# Altium project ScopeMag.PrjPCB
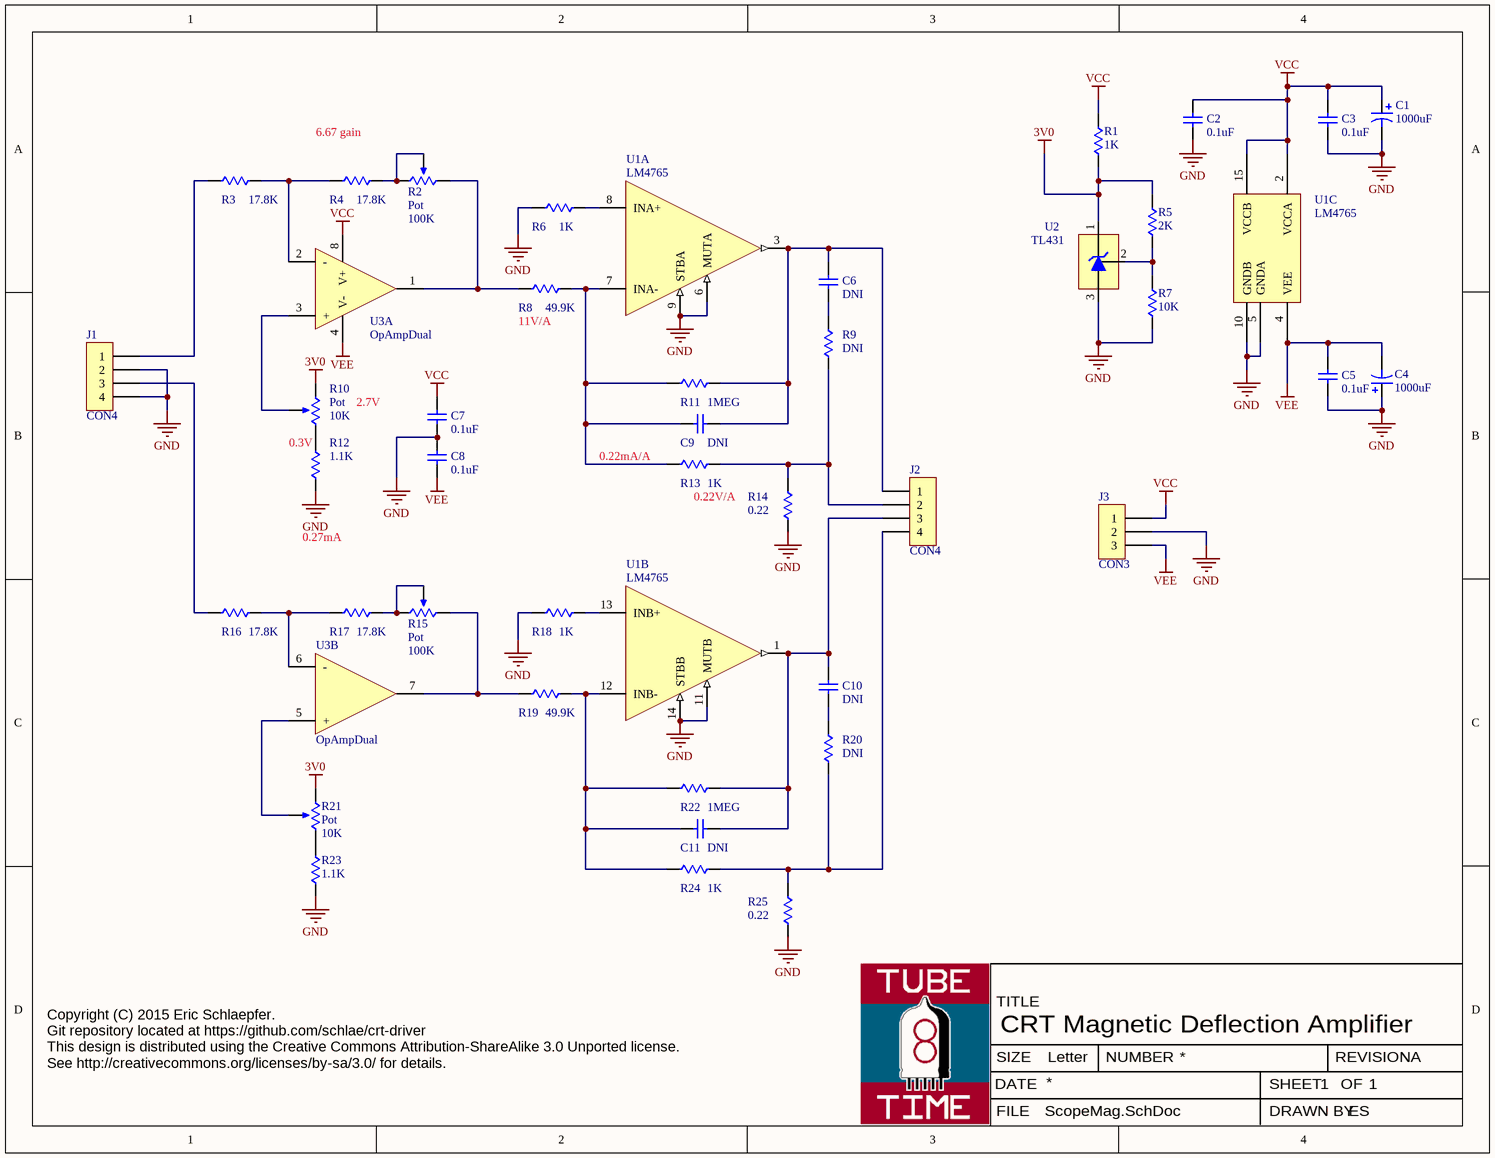
[diagram p0: ScopeMag.SchDoc]
1 sheet, 42 parts. Net scope: global (net labels, ports and power ports of the same name join across sheets).
Board file: ScopeMag.PcbDoc

## Sheet ScopeMag.SchDoc: CRT Magnetic Deflection Amplifier
size Letter; Organization: ES; Revision: A; SheetNumber: 1; SheetTotal: 1

### Parts
C1  value 1000uF  [CAP_R200x400]  (hidden comment: Cap Pol2)
C2  value 0.1uF  [G_0805[2012]]  (hidden comment: Cap)
C3  value 0.1uF  [G_0805[2012]]  (hidden comment: Cap)
C4  value 1000uF  [CAP_R200x400]  (hidden comment: Cap Pol2)
C5  value 0.1uF  [G_0805[2012]]  (hidden comment: Cap)
C6  value DNI  [G_0805[2012]]  (hidden comment: Cap)
C7  value 0.1uF  [G_0805[2012]]  (hidden comment: Cap)
C8  value 0.1uF  [G_0805[2012]]  (hidden comment: Cap)
C9  value DNI  [G_0805[2012]]  (hidden comment: Cap)
C10  value DNI  [G_0805[2012]]  (hidden comment: Cap)
C11  value DNI  [G_0805[2012]]  (hidden comment: Cap)
J1  CON4  [HDR4S]
J2  CON4  [HDR4S156]
J3  CON3  [HDR3S156]
R1  value 1K  [G_0805[2012]]  (hidden comment: Res1)
R2  Pot  value 100K  [POT_TRIM BOURNS 3386F]
R3  value 17.8K  [G_0805[2012]]  (hidden comment: Res1)
R4  value 17.8K  [G_0805[2012]]  (hidden comment: Res1)
R5  value 2K  [G_0805[2012]]  (hidden comment: Res1)
R6  value 1K  [G_0805[2012]]  (hidden comment: Res1)
R7  value 10K  [G_0805[2012]]  (hidden comment: Res1)
R8  value 49.9K  [G_0805[2012]]  (hidden comment: Res1)
R9  value DNI  [G_0805[2012]]  (hidden comment: Res1)
R10  Pot  value 10K  [POT_TRIM BOURNS 3386F]
R11  value 1MEG  [G_0805[2012]]  (hidden comment: Res1)
R12  value 1.1K  [G_0805[2012]]  (hidden comment: Res1)
R13  value 1K  [G_0805[2012]]  (hidden comment: Res1)
R14  value 0.22  [G_2512]  (hidden comment: Res1)
R15  Pot  value 100K  [POT_TRIM BOURNS 3386F]
R16  value 17.8K  [G_0805[2012]]  (hidden comment: Res1)
R17  value 17.8K  [G_0805[2012]]  (hidden comment: Res1)
R18  value 1K  [G_0805[2012]]  (hidden comment: Res1)
R19  value 49.9K  [G_0805[2012]]  (hidden comment: Res1)
R20  value DNI  [G_0805[2012]]  (hidden comment: Res1)
R21  Pot  value 10K  [POT_TRIM BOURNS 3386F]
R22  value 1MEG  [G_0805[2012]]  (hidden comment: Res1)
R23  value 1.1K  [G_0805[2012]]  (hidden comment: Res1)
R24  value 1K  [G_0805[2012]]  (hidden comment: Res1)
R25  value 0.22  [G_2512]  (hidden comment: Res1)
U1  LM4765  [LM4765]  (parts A,B,C of 3)
U2  TL431  [G_SOT23]
U3  OpAmpDual  [G_SO8]  (parts A,B of 2)

### Nets
3V0: R1.2 R5.1 R10.1(TOP) R21.1(TOP) U2.1(C)
GND: C1.2 C2.1 C3.1 C4.1 C5.1 C7.1 C8.2 J1.2 J1.4 J3.2 R6.1 R7.2 R12.2 R14.2 R18.1 R23.2 R25.2 U1.5(GNDA) U1.6(MUTA) U1.9(STBA) U1.10(GNDB) U1.11(MUTB) U1.14(STBB) U2.3(A)
VCC: C1.1 C2.2 C3.2 C7.2 J3.1 R1.1 U1.2(VCCA) U1.15(VCCB) U3.8(V+)
VEE: C4.2 C5.2 C8.1 J3.3 U1.4(VEE) U3.4(V-)
NetC6_1: C6.1 R9.1
NetC6_2: C6.2 C9.1 J2.1 R11.2 U1.3(OUTA)
NetC9_2: C9.2 R8.2 R11.1 R13.1 U1.7(INA-)
NetC10_1: C10.1 R20.1
NetC10_2: C10.2 C11.1 J2.3 R22.2 U1.1(OUTB)
NetC11_2: C11.2 R19.2 R22.1 R24.1 U1.12(INB-)
NetJ1_1: J1.1 R3.1
NetJ1_3: J1.3 R16.1
NetJ2_2: J2.2 R9.2 R13.2 R14.1
NetJ2_4: J2.4 R20.2 R24.2 R25.1
NetR2_1: R2.1(TOP) R8.1 U3.1(OUTA)
NetR2_2: R2.2(BOT) R2.3(TAP) R4.2
NetR3_2: R3.2 R4.1 U3.2(-)
NetR5_2: R5.2 R7.1 U2.2(REF)
NetR6_2: R6.2 U1.8(INA+)
NetR10_2: R10.2(BOT) R12.1
NetR10_3: R10.3(TAP) U3.3(+)
NetR15_1: R15.1(TOP) R19.1 U3.7(OUTB)
NetR15_2: R15.2(BOT) R15.3(TAP) R17.2
NetR16_2: R16.2 R17.1 U3.6(-)
NetR18_2: R18.2 U1.13(INB+)
NetR21_2: R21.2(BOT) R23.1
NetR21_3: R21.3(TAP) U3.5(+)

### Notes on the sheet
- 6.67 gain
- (near R8) 11V/A
- 2.7V
- (near R12) 0.3V
- (near R13) 0.22mA/A
- (near R13) 0.22V/A
- 0.27mA
- Copyright (C) 2015 Eric Schlaepfer.
  Git repository located at https://github.com/schlae/crt-driver
  This design is distributed using the Creative Commons Attribution-ShareAlike 3.0 Unported license.
  See http://creativecommons.org/licenses/by-sa/3.0/ for details.
- TITLE
- DATE
- SIZE
- Letter
- NUMBER
- SHEET
- REVISION
- OF
- FILE
- DRAWN BY

### Library data of the parts
C1 C4 = CapP: Polarized Capacitor; ManufPart: UVR1E102MPD; Mouser: 647-UVR1E102MPD
C2 C3 C5-C11 = Cap: Capacitor
  C2 C3 C5 C7 C8: Mouser: 810-C2012X8R1H104K
J1 = CON4: Connector, 4 pin; ManufPart: 42375-1863; Mouser: 538-42375-1863
J2 = CON4: Connector, 4 pin; Mouser: 538-26-48-1041; ManufPart: 26-48-1041
J3 = CON3: Connector, 3 pin; Mouser: 538-26-48-1031; ManufPart: 26-48-1031
R1 R3-R9 R11-R14 R16-R20 R22-R25 = Res: Resistor
  R1 R6 R13 R18 R24: Mouser: 71-CRCW0805-1.0K-E3
  R3 R4 R16 R17: Mouser: 71-CRCW0805-17.8K-E3
  R5: Mouser: 71-CRCW0805-2.0K-E3
  R7: Mouser: 71-CRCW080510K0FKEB
  R8 R19: Mouser: 71-CRCW0805-49.9K-E3
  R11 R22: Mouser: 71-CRCW0805-1.0M-E3
  R12 R23: Mouser: 71-CRCW0805-1.1K-E3
  R14 R25: Mouser: 652-CRL2512JWR220ELF
R2 R10 R15 R21 = Pot: Variable Resistor
  R2 R15: Mouser: 652-3386F-1-104LF
  R10 R21: Mouser: 652-3386F-1-103LF
U2 = TL431: Adjustable Shunt Reg; Mouser: 522-ZTL431AFTA
U3 = OpAmpDual: Generic Dual Op Amp; Mouser: 511-TL082CDT
U1 = LM4765: Mouser: 926-LM4765T/NOPB